# EAGLE design leachamp4_5 (EAGLE 5.06)
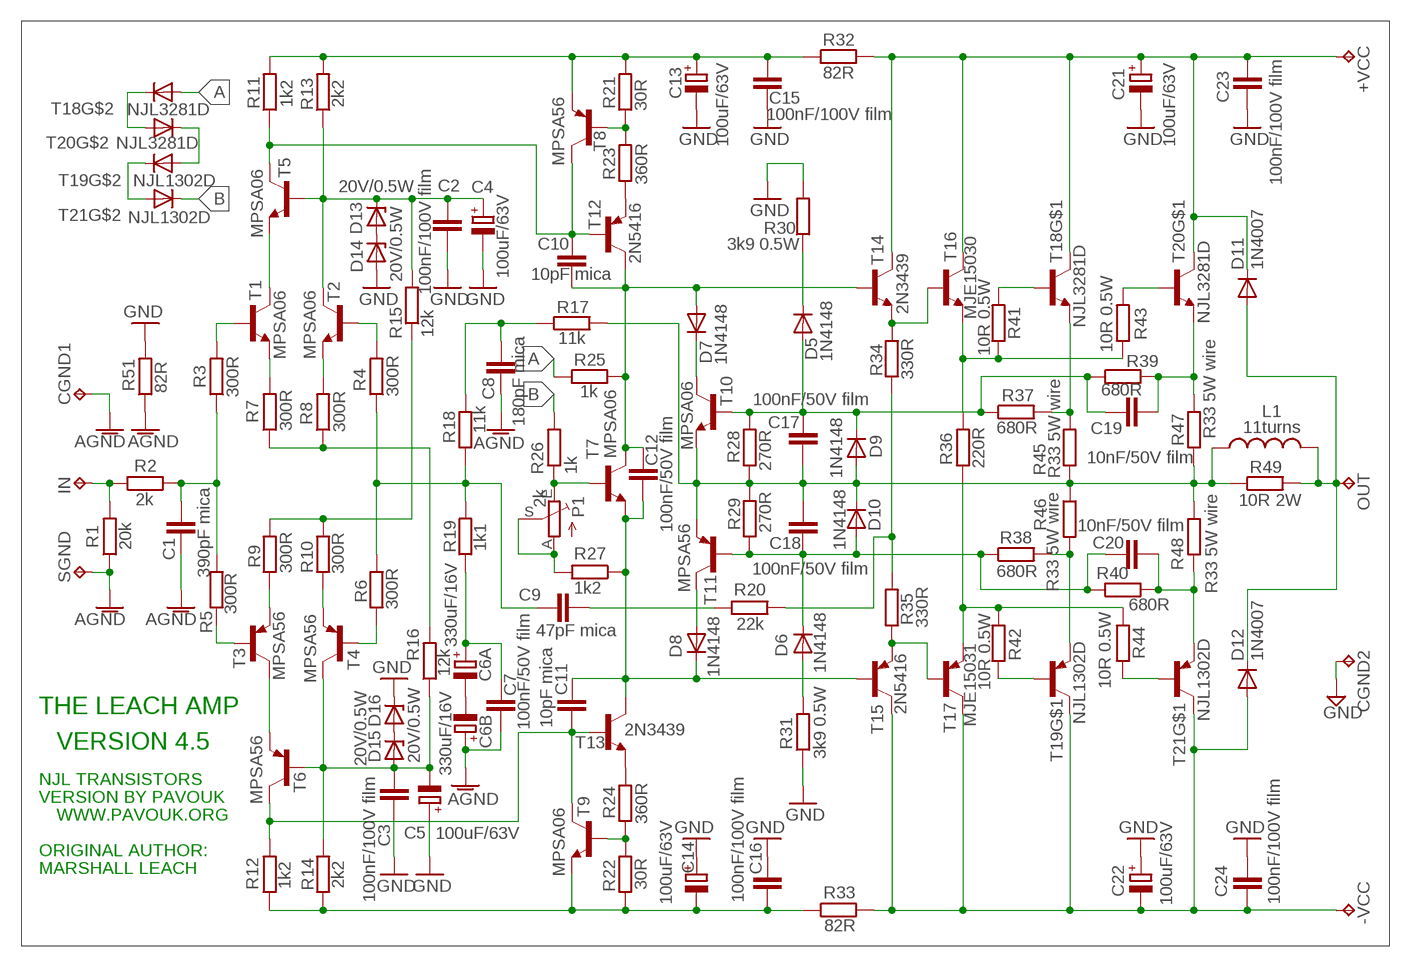
[diagram p0: schematic, sheet 1]

## Parts
+VCC  TPPAD1-20  [P1-20]
-VCC  TPPAD1-20  [P1-20]
C1  390pF mica  C-EU050-025X075  [C050-025X075]
C2  100nF/100V film  C-EU050-035X075  [C050-035X075]
C3  100nF/100V film  C-EU050-035X075  [C050-035X075]
C4  100uF/63V  CPOL-EUE5-8.5  [E5-8,5]
C5  100uF/63V  CPOL-EUE5-8.5  [E5-8,5]
C6A  330uF/16V  CPOL-EUE5-6  [E5-6]
C6B  330uF/16V  CPOL-EUE5-6  [E5-6]
C7  100nF/50V film  C-EU050-025X075  [C050-025X075]
C8  180pF mica  C-EU050-025X075  [C050-025X075]
C9  47pF mica  C-EU050-025X075  [C050-025X075]
C10  10pF mica  C-EU050-025X075  [C050-025X075]
C11  10pF mica  C-EU050-025X075  [C050-025X075]
C12  100nF/50V film  C-EU050-025X075  [C050-025X075]
C13  100uF/63V  CPOL-EUE5-8.5  [E5-8,5]
C14  100uF/63V  CPOL-EUE5-8.5  [E5-8,5]
C15  100nF/100V film  C-EU050-035X075  [C050-035X075]
C16  100nF/100V film  C-EU050-035X075  [C050-035X075]
C17  100nF/50V film  C-EU050-025X075  [C050-025X075]
C18  100nF/50V film  C-EU050-025X075  [C050-025X075]
C19  10nF/50V film  C-EU075-032X103  [C075-032X103]
C20  10nF/50V film  C-EU075-032X103  [C075-032X103]
C21  100uF/63V  CPOL-EUE5-8.5  [E5-8,5]
C22  100uF/63V  CPOL-EUE5-8.5  [E5-8,5]
C23  100nF/100V film  C-EU050-035X075  [C050-035X075]
C24  100nF/100V film  C-EU050-035X075  [C050-035X075]
CGND1  TPPAD1-17Y  [P1-17Y]
CGND2  TPPAD1-17Y  [P1-17Y]
D5  1N4148  1N4148DO35-10  [DO35-10]
D6  1N4148  1N4148DO35-10  [DO35-10]
D7  1N4148  1N4148DO35-10  [DO35-10]
D8  1N4148  1N4148DO35-10  [DO35-10]
D9  1N4148  1N4148DO35-7  [DO35-7]
D10  1N4148  1N4148DO35-7  [DO35-7]
D11  1N4007  1N4004  [DO41-10]
D12  1N4007  1N4004  [DO41-10]
D13  20V/0.5W  ZENER-DIODEZD-7.5  [ZDIO-7.5]
D14  20V/0.5W  ZENER-DIODEZD-7.5  [ZDIO-7.5]
D15  20V/0.5W  ZENER-DIODEZD-7.5  [ZDIO-7.5]
D16  20V/0.5W  ZENER-DIODEZD-7.5  [ZDIO-7.5]
IN  TPPAD1-17Y  [P1-17Y]
L1  11turns  L-USIRF-36  [IRF36]
OUT  TPPAD1-17Y  [P1-17Y]
P1  2k  TRIM_EU-S63P  [S63P]
R1  20k  R-EU_0207/10  [0207/10]
R2  2k  R-EU_0207/10  [0207/10]
R3  300R  R-EU_0207/10  [0207/10]
R4  300R  R-EU_0207/10  [0207/10]
R5  300R  R-EU_0207/10  [0207/10]
R6  300R  R-EU_0207/10  [0207/10]
R7  300R  R-EU_0207/10  [0207/10]
R8  300R  R-EU_0207/10  [0207/10]
R9  300R  R-EU_0207/10  [0207/10]
R10  300R  R-EU_0207/10  [0207/10]
R11  1k2  R-EU_0207/10  [0207/10]
R12  1k2  R-EU_0207/10  [0207/10]
R13  2k2  R-EU_0207/10  [0207/10]
R14  2k2  R-EU_0207/10  [0207/10]
R15  12k  R-EU_0207/10  [0207/10]
R16  12k  R-EU_0207/10  [0207/10]
R17  11k  R-EU_0207/10  [0207/10]
R18  11k  R-EU_0207/10  [0207/10]
R19  1k1  R-EU_0207/10  [0207/10]
R20  22k  R-EU_0207/10  [0207/10]
R21  30R  R-EU_0207/10  [0207/10]
R22  30R  R-EU_0207/10  [0207/10]
R23  360R  R-EU_0207/10  [0207/10]
R24  360R  R-EU_0207/10  [0207/10]
R25  1k  R-EU_0207/10  [0207/10]
R26  1k  R-EU_0207/10  [0207/10]
R27  1k2  R-EU_0207/10  [0207/10]
R28  270R  R-EU_0207/10  [0207/10]
R29  270R  R-EU_0207/10  [0207/10]
R30  3k9 0.5W  R-EU_0207/10  [0207/10]
R31  3k9 0.5W  R-EU_0207/10  [0207/10]
R32  82R  R-EU_0207/10  [0207/10]
R33  82R  R-EU_0207/10  [0207/10]
R34  330R  R-EU_0207/10  [0207/10]
R35  330R  R-EU_0207/10  [0207/10]
R36  220R  R-EU_0207/12  [0207/12]
R37  680R  R-EU_0207/10  [0207/10]
R38  680R  R-EU_0207/10  [0207/10]
R39  680R  R-EU_0207/10  [0207/10]
R40  680R  R-EU_0207/10  [0207/10]
R41  10R 0.5W  R-EU_0207/10  [0207/10]
R42  10R 0.5W  R-EU_0207/10  [0207/10]
R43  10R 0.5W  R-EU_0207/10  [0207/10]
R44  10R 0.5W  R-EU_0207/10  [0207/10]
R45  R33 5W wire  R-EU_0922V  [0922V]
R46  R33 5W wire  R-EU_0922V  [0922V]
R47  R33 5W wire  R-EU_0922V  [0922V]
R48  R33 5W wire  R-EU_0922V  [0922V]
R49  10R 2W  R-EU_0817/22  [P0817/22]
R51  82R  R-EU_0207/10  [0207/10]
SGND  TPPAD1-17Y  [P1-17Y]
T1  MPSA06  BC546A-NPN-TO92-EBC  [TO92-EBC]
T2  MPSA06  BC546A-NPN-TO92-EBC  [TO92-EBC]
T3  MPSA56  BC556A-PNP-TO92-EBC  [TO92-EBC]
T4  MPSA56  BC556A-PNP-TO92-EBC  [TO92-EBC]
T5  MPSA06  BC546A-NPN-TO92-EBC  [TO92-EBC]
T6  MPSA56  BC556A-PNP-TO92-EBC  [TO92-EBC]
T7  MPSA06  BC546A-NPN-TO92-EBC  [TO92-EBC]
T8  MPSA56  BC556A-PNP-TO92-EBC  [TO92-EBC]
T9  MPSA06  BC546A-NPN-TO92-EBC  [TO92-EBC]
T10  MPSA06  BC546A-NPN-TO92-EBC  [TO92-EBC]
T11  MPSA56  BC556A-PNP-TO92-EBC  [TO92-EBC]
T12  2N5416  2N5416-PNP-TO39-EBC  [TO39]
T13  2N3439  [TO5]
T14  2N3439  [TO5]
T15  2N5416  2N5416-PNP-TO39-EBC  [TO39]
T16  MJE15030  -NPN-TO220V  [TO220V]
T17  MJE15031  -PNP-TO220V  [TO220V]
T18  NJL3281D  [TO264-5]
T19  NJL1302D  [TO264-5]
T20  NJL3281D  [TO264-5]
T21  NJL1302D  [TO264-5]

## Nets
A: R25.1 T18.ANODE(A)
AGND: C1.2 C6B.+ C7.2 C8.2 CGND1.1(TP) R1.1 R51.1 SGND.1(TP)
B: R26.2 T21.CATHODE(C)
GND: C2.2 C3.2 C4.- C5.+ C13.- C14.+ C15.2 C16.1 C21.- C22.+ C23.2 C24.1 CGND2.1(TP) D14.A D16.C R30.2 R31.1 R51.2
N$1: R21.1 R23.2 T8.B
N$2: R22.2 R24.1 T9.B
N$3: C17.2 C18.1 D9.A D10.C L1.1 R17.2 R28.1 R29.2 R45.1 R46.1 R47.1 R48.1 R49.1 T10.E T11.E
N$4: D13.A D14.C
N$5: D15.C D16.A
N$6: T18.CATHODE(C) T20.ANODE(A)
N$7: T19.ANODE(A) T20.CATHODE(C)
N$8: T19.CATHODE(C) T21.ANODE(A)
N$9: R24.2 T13.1(E)
N$10: D11.A D12.C L1.2 OUT.1(TP) R49.2
N$11: C8.1 R17.1 R18.2
N$12: P1.A P1.S R27.2
N$13: P1.E R26.1 T7.B
N$14: C14.- C16.2 R12.1 R14.1 R22.1 R33.1 T9.E
N$15: C11.1 C12.2 D8.C R27.1 T7.E T13.3(C) T15.2(B)
N$16: C10.2 C12.1 D7.A R25.2 T7.C T12.3(C) T14.2(B)
N$17: C11.2 R12.2 T6.C T9.C T13.2(B)
N$18: R23.1 T12.1(E)
N$19: C13.+ C15.1 R11.2 R13.2 R21.2 R32.1 T8.E
N$20: C10.1 R11.1 T5.C T8.C T12.2(B)
N$21: R4.2 T2.B
N$22: R3.2 T1.B
N$23: R8.2 T2.E
N$24: R7.2 T1.E
N$25: R7.1 R8.1 R16.2
N$26: R9.2 R10.2 R15.1
N$27: C9.1 R4.1 R6.2 R18.1 R19.2
N$28: D8.A T11.C
N$29: R5.1 T3.B
N$30: R6.1 T4.B
N$32: R37.2 R45.2 T18.EMITTER(E)
N$33: C6A.+ C7.1 R19.1
N$34: R35.1 T15.1(E) T17.1(B)
N$35: C1.1 R2.2 R3.1 R5.2
N$36: IN.1(TP) R1.2 R2.1
N$37: C3.1 C5.- D15.A R14.2 R16.1 T4.C T6.B
N$38: T3.C T6.E
N$39: R9.1 T3.E
N$40: R10.1 T4.E
N$41: C2.1 C4.+ D13.C R13.1 R15.2 T2.C T5.B
N$42: T1.C T5.E
N$43: R20.2 R34.1 R35.2
N$44: D6.A R31.2
N$45: D5.C R30.1
N$46: C9.2 R20.1
N$47: C17.1 C19.1 D5.A D9.C R28.2 R37.1 R39.1 T10.B
N$48: C18.2 C20.1 D6.C D10.A R29.1 R38.1 R40.1 T11.B
N$49: D7.C T10.C
N$50: R38.2 R46.2 T19.EMITTER(E)
N$51: R34.2 T14.1(E) T16.1(B)
N$52: C6A.- C6B.-
N$53: C20.2 R40.2 R48.2 T21.EMITTER(E)
N$54: C19.2 R39.2 R47.2 T20.EMITTER(E)
N$56: R41.2 T18.BASE(B)
N$57: R43.2 T20.BASE(B)
N$58: R36.2 R41.1 R43.1 T16.3(E)
N$60: R44.1 T21.BASE(B)
N$61: R42.1 T19.BASE(B)
N$62: R36.1 R42.2 R44.2 T17.3(E)
N$63: -VCC.1(TP) C22.- C24.2 D12.A R33.2 T15.3(C) T17.2(C) T19.COLLECTOR(C) T21.COLLECTOR(C)
N$64: +VCC.1(TP) C21.+ C23.1 D11.C R32.2 T14.3(C) T16.2(C) T18.COLLECTOR(C) T20.COLLECTOR(C)

## Notes on the sheet
- THE LEACH AMP
- VERSION 4.5
- NJL TRANSISTORS
- VERSION BY PAVOUK
- WWW.PAVOUK.ORG
- ORIGINAL AUTHOR:
- MARSHALL LEACH

## Library data of the parts
+VCC -VCC CGND1 CGND2 IN OUT SGND = testpad:TP: Test pad
C1-C3 C7-C12 C15-C20 C23 C24 = rcl:C-EU: CAPACITOR, European symbol
C4 C5 C6A C6B C13 C14 C21 C22 = rcl:CPOL-EU: POLARIZED CAPACITOR, European symbol
D5-D10 = diode:1N4148: DIODE high speed (Philips)
D11 D12 = diode:1N4004: DIODE general purpose rectifier, 1 A
D13-D16 = diode:ZENER-DIODE: Z-Diode
L1 = rcl:L-US: INDUCTOR, American symbol
P1 = pot:TRIM_EU-: POTENTIOMETER
R1-R49 R51 = rcl:R-EU_: RESISTOR, European symbol
T1 T2 T5 T7 T9 T10 T16 = transistor:*-NPN-: NPN Transistror BF959 corrected 2008.03.06
T3 T4 T6 T8 T11 T12 T15 T17 = transistor:*-PNP-: PNP Transistror
T13 T14 = transistor:2N3439: NPN TRANSISTOR
T18 T20 = pavouk:NJL3281D: Bipolar power transistor 15 AMP, 260 VOLT, 200 WATT with bias diode.
T19 T21 = pavouk:NJL1302D: Bipolar power transistor 15 AMP, 260 VOLT, 200 WATT with bias diode.

## Board
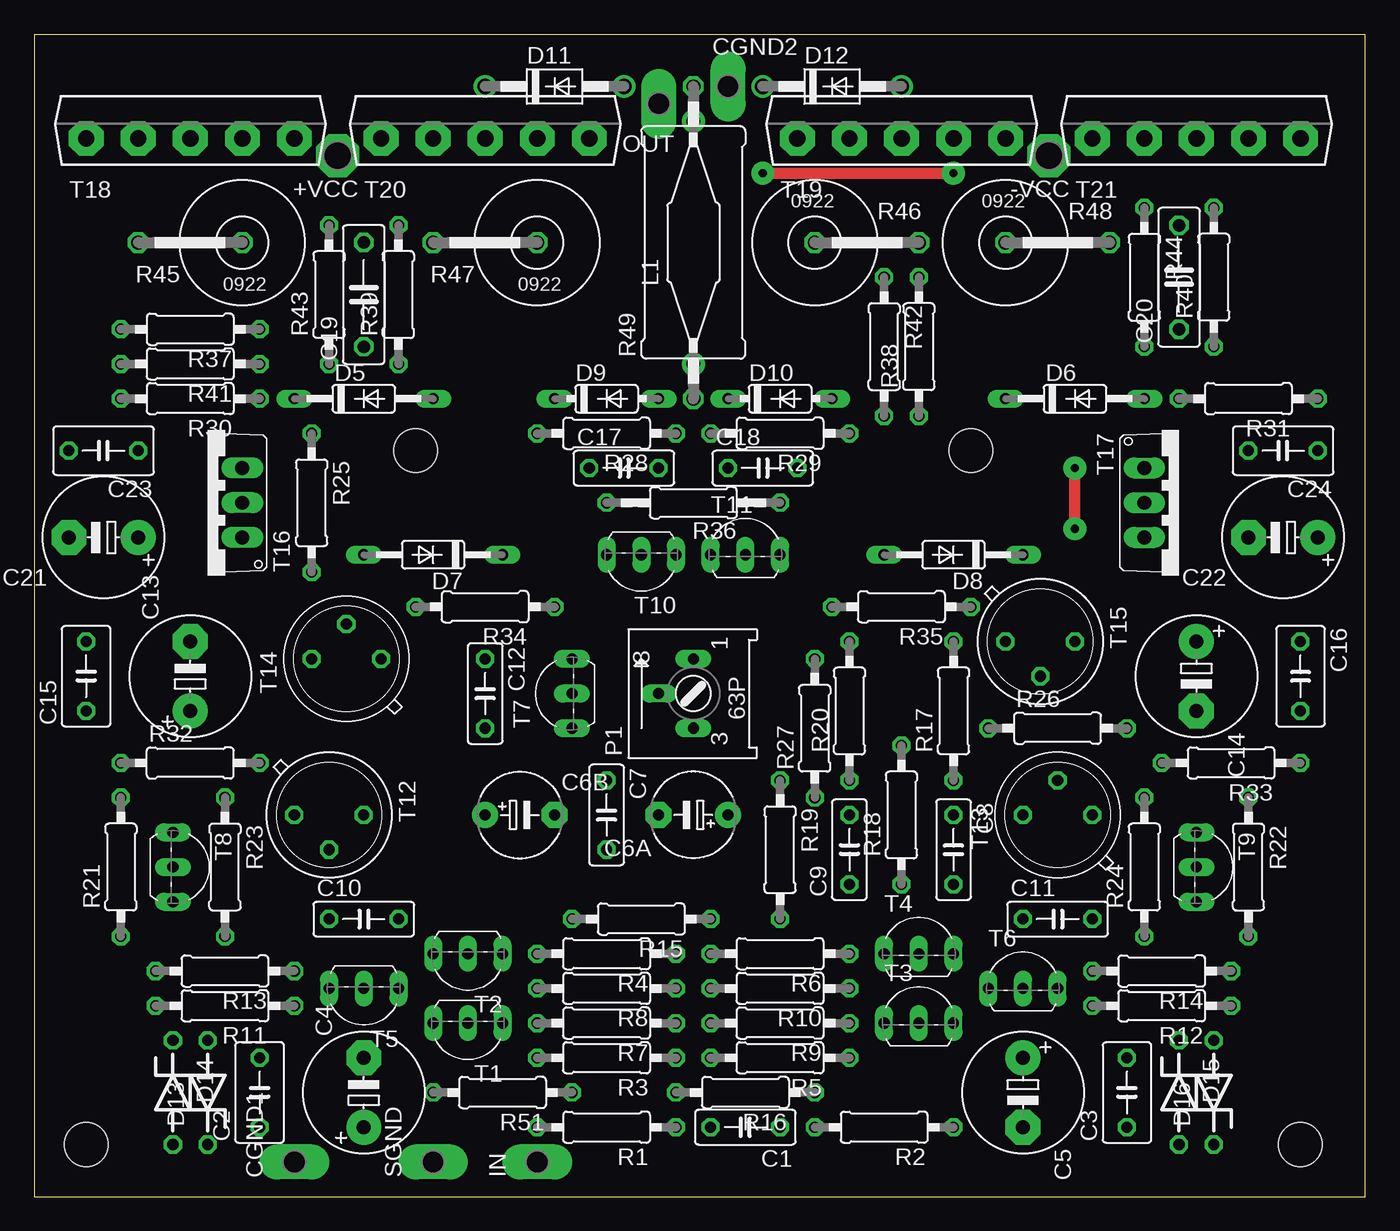
[diagram p1: board, top side]
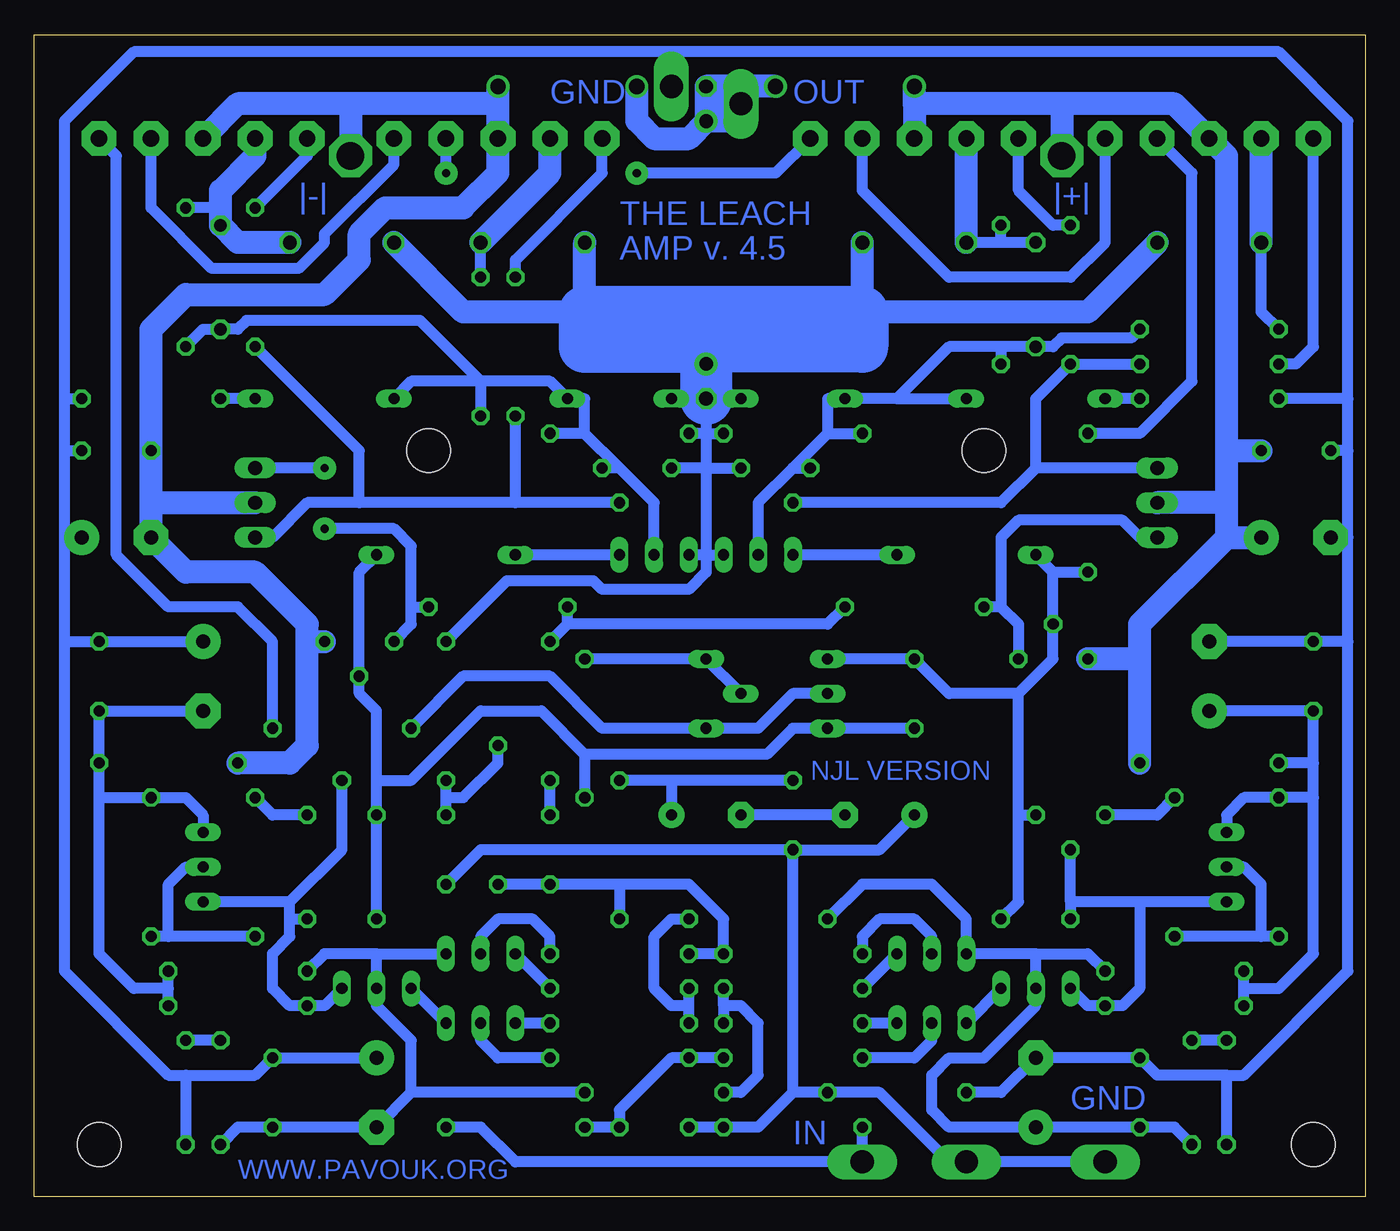
[diagram p2: board, bottom side, seen from below]

Size 97.46 x 85.08 mm. Coordinates in mm from the lower left corner, seen from the top.
Outline: 0,0 97.46,0 97.46,85.08 0,85.08 0,0
Copper layers (1*16): Top 0.035mm / dielectric 1.5mm / Bottom 0.035mm
Design rules "default *": minimum track width 10mil, minimum drill 24mil, track to track 8mil, track to pad 8mil, pad to pad 8mil, via to via 8mil, smd to smd 8mil, copper to edge 40mil, drill to drill 8mil, minimum pad ring 10mil, minimum via ring 8mil, stop-mask expansion 4mil, vias tented up to drill 0mil, thermal gap 10mil
Holes 3.2 mm at 3.81,3.81 92.71,3.81 27.94,54.61 68.58,54.61

### Footprints (pad centres in the part's own frame; a part is rotated, then mirrored left to right if it is on the bottom)
P1-20 = drill 2.007 pad 3.15 octagon: 1 0,0
C050-025X075 = drill 0.813 octagon: 1 -2.54,0; 2 2.54,0
C050-035X075 = drill 0.813 octagon: 1 -2.54,0; 2 2.54,0
E5-8,5 = drill 1.016 pad 2.54 round: + -2.54,0 | drill 1.016 pad 2.54 octagon: - 2.54,0
E5-6 = drill 0.813 pad 1.905 round: + -2.54,0 | drill 0.813 pad 1.905 octagon: - 2.54,0
C075-032X103 = drill 0.914 octagon: 1 -3.81,0; 2 3.81,0
P1-17Y = drill 1.702 pad 2.121 long: 1 0,0
DO35-10 = drill 0.813 long: A 5.08,0; C -5.08,0
DO35-7 = drill 0.813 long: A 3.81,0; C -3.81,0
DO41-10 = drill 1.118 round: A 5.08,0; C -5.08,0
ZDIO-7.5 = drill 0.813 octagon: A 3.81,0; C -3.81,0
IRF36 = drill 1 pad 1.676 round: 1 -8.89,0; 2 8.89,0
S63P = drill 0.813 long: A 2.54,0; E -2.54,0; S 0,2.54
0207/10 = drill 0.813 octagon: 1 -5.08,0; 2 5.08,0
0207/12 = drill 0.813 octagon: 1 -6.35,0; 2 6.35,0
0922V = drill 1.016 octagon: 1 -5.08,0; 2 2.54,0
P0817/22 = drill 1.016 octagon: 1 -11.43,0; 2 11.43,0
TO92-EBC = drill 0.813 long: B 0,-1.27; C 2.54,-1.27; E -2.54,-1.27
TO39 = drill 0.813 octagon: 1 0,-2.54; 2 2.54,0; 3 0,2.54
TO5 = drill 0.813 octagon: 1 0,-2.54; 2 2.54,0; 3 0,2.54
TO220V = drill 1.016 long: 1 -2.54,-2.54; 2 0,-2.54; 3 2.54,-2.54
TO264-5 = drill 1.2 pad 2.54 octagon: ANODE 3.81,0; BASE -7.62,0; CATHODE 7.62,0; COLLECTOR 0,0; EMITTER -3.81,0

### Placement (x,y rotation side)
+VCC  22.23,76.2 180 top
-VCC  74.3,76.2 180 top
C1  52.07,5.08 180 top
C2  16.51,7.62 90 top
C3  80.01,7.62 90 top
C4  24.13,7.62 90 top
C5  72.39,7.62 270 top
C6A  48.26,27.94 180 top
C6B  35.56,27.94 0 top
C7  41.91,27.94 270 top
C8  67.31,25.4 270 top
C9  59.69,25.4 90 top
C10  24.13,20.32 0 top
C11  74.93,20.32 0 top
C12  33.02,36.83 270 top
C13  11.43,38.1 90 top
C14  85.09,38.1 270 top
C15  3.81,38.1 90 top
C16  92.71,38.1 270 top
C17  43.18,53.34 0 top
C18  53.34,53.34 0 top
C19  24.13,66.04 90 top
C20  83.82,67.31 90 top
C21  5.08,48.26 180 top
C22  91.44,48.26 180 top
C23  5.08,54.61 180 top
C24  91.44,54.61 180 top
CGND1  19.05,2.54 90 top
CGND2  50.8,81.28 0 top
D5  24.13,58.42 0 top
D6  76.2,58.42 0 top
D7  29.21,46.99 180 top
D8  67.31,46.99 180 top
D9  41.91,58.42 0 top
D10  54.61,58.42 0 top
D11  38.1,81.28 0 top
D12  58.42,81.28 0 top
D13  12.7,7.62 90 top
D14  10.16,7.62 270 top
D15  83.82,7.62 270 top
D16  86.36,7.62 90 top
IN  36.83,2.54 90 top
L1  48.26,69.85 90 top
OUT  45.72,80.01 180 top
P1  48.26,36.83 90 top
R1  41.91,5.08 180 top
R2  62.23,5.08 180 top
R3  41.91,10.16 180 top
R4  41.91,17.78 180 top
R5  54.61,10.16 180 top
R6  54.61,17.78 180 top
R7  41.91,12.7 180 top
R8  41.91,15.24 180 top
R9  54.61,12.7 180 top
R10  54.61,15.24 180 top
R11  13.97,13.97 180 top
R12  82.55,13.97 180 top
R13  13.97,16.51 180 top
R14  82.55,16.51 180 top
R15  44.45,20.32 180 top
R16  52.07,7.62 180 top
R17  67.31,35.56 90 top
R18  63.5,27.94 90 top
R19  54.61,25.4 270 top
R20  59.69,35.56 90 top
R21  6.35,24.13 90 top
R22  88.9,24.13 270 top
R23  13.97,24.13 270 top
R24  81.28,24.13 90 top
R25  20.32,50.8 270 top
R26  74.93,34.29 0 top
R27  57.15,34.29 90 top
R28  41.91,55.88 180 top
R29  54.61,55.88 180 top
R30  11.43,58.42 180 top
R31  88.9,58.42 180 top
R32  11.43,31.75 0 top
R33  87.63,31.75 180 top
R34  33.02,43.18 180 top
R35  63.5,43.18 180 top
R36  48.26,50.8 180 top
R37  11.43,63.5 180 top
R38  64.77,62.23 90 top
R39  26.67,66.04 90 top
R40  86.36,67.31 90 top
R41  11.43,60.96 180 top
R42  62.23,62.23 270 top
R43  21.59,66.04 90 top
R44  81.28,67.31 270 top
R45  10.16,69.85 180 top
R46  62.23,69.85 0 top
R47  31.75,69.85 180 top
R48  76.2,69.85 0 top
R49  48.26,69.85 90 top
R51  34.29,7.62 180 top
SGND  29.21,2.54 90 top
T1  31.75,11.43 180 top
T2  31.75,16.51 180 top
T3  64.77,13.97 0 top
T4  64.77,19.05 0 top
T5  24.13,13.97 180 top
T6  72.39,16.51 0 top
T7  38.1,36.83 90 top
T8  11.43,24.13 270 top
T9  86.36,24.13 270 top
T10  44.45,45.72 180 top
T11  52.07,48.26 0 top
T12  21.59,27.94 270 top
T13  74.93,27.94 90 top
T14  22.86,39.37 90 top
T15  73.66,40.64 270 top
T16  12.7,50.8 90 top
T17  83.82,50.8 270 top
T18  11.43,77.47 0 top
T19  63.5,77.47 0 top
T20  33.02,77.47 0 top
T21  85.09,77.47 0 top

### Tracks (layer width: path | path; a pad name or v marks a point on that pad's centre or on a via)
A
  Bottom 0.813: R25.1 16.51,55.88 12.7,59.69 12.7,74.93 T18.ANODE
AGND
  Bottom 0.813: C1.2 R1.1 44.45,5.08 41.91,7.62 | 41.91,7.62 R51.1 35.56,7.62 30.48,2.54 SGND.1 CGND1.1 | 41.91,7.62 C7.2 | C6B.+ 35.56,25.4 C7.2 | C8.2 64.77,25.4 C7.2
B
  Bottom 0.813: R26.2 80.01,40.64 82.55,43.18 87.63,43.18 91.44,46.99 91.44,76.2 T21.CATHODE
GND
  Bottom 0.813: C5.+ C3.2 81.28,8.89 86.36,8.89 | 86.36,8.89 D16.C | 10.16,8.89 15.24,8.89 C2.2 C4.- 26.67,7.62 R51.2 | D14.A 10.16,8.89 | C13.- C15.2 1.27,40.64 | C14.+ C16.1 95.25,40.64 | 1.27,40.64 1.27,16.51 8.89,8.89 10.16,8.89 | 95.25,40.64 95.25,16.51 87.63,8.89 86.36,8.89 | 95.25,58.42 95.25,54.61 | 95.25,54.61 95.25,48.26 | 95.25,48.26 95.25,40.64 | 95.25,58.42 R31.1 | 1.27,58.42 R30.2 | 1.27,40.64 1.27,48.26 | 1.27,48.26 1.27,54.61 | 1.27,54.61 1.27,58.42 | 95.25,58.42 95.25,78.74 90.17,83.82 50.8,83.82 | 50.8,83.82 6.35,83.82 1.27,78.74 1.27,58.42 | 1.27,54.61 C23.2 | 1.27,48.26 C21.- | 95.25,48.26 C22.+ | 95.25,54.61 C24.1 | 50.8,83.82 CGND2.1
N$1
  Bottom 0.813: R21.1 7.62,19.05 | 7.62,19.05 R23.2 | T8.B 8.89,24.13 7.62,22.86 7.62,19.05
N$2
  Bottom 0.813: R24.1 87.63,19.05 | 87.63,19.05 R22.2 | T9.B 86.36,24.13 87.63,22.86 87.63,19.05
N$3
  Bottom 0.813: 48.26,46.99 T10.E | 48.26,46.99 T11.E | 48.26,53.34 C17.2 | 48.26,53.34 48.26,46.99 | 48.26,53.34 C18.1 | 48.26,55.88 48.26,53.34 | R49.1 48.26,55.88 | R49.1 D9.A | R49.1 D10.C | 48.26,46.99 48.26,45.72 49.53,44.45 55.88,44.45 56.52,45.09 62.87,45.09 R17.2 | 48.26,55.88 R28.1 | 48.26,55.88 R29.2
  Bottom 1.676: R45.1 20.32,64.77 36.83,64.77 R47.1 | R48.1 66.04,64.77 57.15,64.77 R46.1
  Bottom 3.81: 48.26,62.23 36.83,62.23 36.83,64.77 57.15,64.77 57.15,62.23 48.26,62.23 | 48.26,62.23 L1.1 R49.1
N$4
  Bottom 0.813: D14.C D13.A
N$5
  Bottom 0.813: D15.C D16.A
N$6
  Bottom 0.813: T18.CATHODE 19.05,69.85 21.59,67.31 30.48,67.31 36.83,73.66 T20.ANODE
N$7  (via drill 0.6 pad 1.68)
  Top 0.813: v53.34,74.93 v67.31,74.93
  Bottom 0.813: T20.CATHODE 43.18,74.93 v53.34,74.93 | v67.31,74.93 T19.ANODE
N$8
  Bottom 0.813: T21.ANODE 88.9,72.39 84.45,67.94 78.11,67.94 76.2,69.85 76.2,70.48 71.12,75.56 T19.CATHODE
N$9
  Bottom 0.813: T13.1 80.01,27.94 R24.2
N$10
  Bottom 1.676: D12.C 53.34,78.74 52.07,77.47 49.53,77.47 L1.2 | 48.26,80.01 R49.2 45.72,81.28 | 48.26,80.01 L1.2 | L1.2 45.72,78.74 OUT.1 | OUT.1 48.26,80.01 | 45.72,81.28 OUT.1 | D11.A 45.72,81.28
N$11
  Bottom 0.813: C8.1 67.31,29.21 | 67.31,29.21 R17.1 | R18.2 63.5,31.75 66.04,29.21 67.31,29.21
N$12
  Bottom 0.813: R27.2 P1.A P1.S
N$13
  Bottom 0.813: R26.1 66.04,38.1 59.69,38.1 55.88,34.29 P1.E 44.45,34.29 41.91,36.83 T7.B
N$14
  Bottom 0.813: R12.1 87.63,15.24 | 87.63,15.24 R14.1 | T9.E 85.09,27.94 86.36,29.21 R22.1 92.71,29.21 | 92.71,29.21 92.71,17.78 90.17,15.24 87.63,15.24 | C14.- C16.2 R33.1 92.71,29.21
N$15
  Bottom 0.813: C12.2 T7.E 41.91,34.29 43.81,32.38 57.15,32.38 | 57.15,32.38 R27.1 | C11.1 T13.3 72.39,30.48 | D8.C 73.66,45.72 T15.2 73.66,36.83 72.39,35.56 72.39,30.48 | 72.39,30.48 69.85,30.48 64.77,35.56 60.33,35.56 57.15,32.38
N$16
  Bottom 0.813: 25.4,27.94 T12.3 | T7.C C12.1 30.48,36.83 25.4,36.83 | 25.4,27.94 25.4,21.59 C10.2 | 22.86,45.72 T14.2 22.86,39.37 25.4,36.83 | 22.86,45.72 D7.A | 22.86,45.72 R25.2 | 25.4,27.94 25.4,36.83
N$17
  Bottom 0.813: T6.C 76.2,13.97 R12.2 78.74,13.97 80.01,15.24 80.01,17.78 78.74,19.05 78.74,20.32 | 78.74,20.32 78.74,21.59 | 78.74,21.59 74.93,25.4 T13.2 | 78.74,20.32 C11.2 | 78.74,21.59 T9.C
N$18
  Bottom 0.813: T12.1 15.24,27.94 R23.1
N$19
  Bottom 0.813: R11.2 8.89,15.24 | 8.89,15.24 R13.2 | 3.81,29.21 R21.2 8.89,29.21 10.16,27.94 T8.E | 3.81,29.21 3.81,17.78 6.35,15.24 8.89,15.24 | C13.+ C15.1 3.81,31.75 | 3.81,29.21 3.81,31.75 | 3.81,31.75 R32.1
N$20
  Bottom 0.813: T5.C 20.32,13.97 R11.1 17.78,13.97 16.51,15.24 16.51,21.59 | 21.59,21.59 C10.1 | 21.59,21.59 T12.2 | T8.C 16.51,21.59 | 16.51,21.59 21.59,21.59
N$21
  Bottom 0.813: T2.B 31.75,19.05 33.02,20.32 35.56,20.32 36.83,19.05 R4.2
N$22
  Bottom 0.813: R3.2 33.02,10.16 31.75,11.43 T1.B
N$23
  Bottom 0.813: T2.E R8.2
N$24
  Bottom 0.813: T1.E R7.2
N$25
  Bottom 0.813: 46.99,13.97 R7.1 | 46.99,13.97 R8.1 | R16.2 45.72,7.62 44.45,8.89 44.45,12.7 45.72,13.97 46.99,13.97
N$26
  Bottom 0.813: R9.2 49.53,13.97 | 49.53,13.97 R10.2 | R15.1 50.8,20.32 52.07,19.05 52.07,15.24 50.8,13.97 49.53,13.97
N$27
  Bottom 0.813: R18.1 C9.1 54.61,22.86 | R6.2 R4.1 46.99,20.32 49.53,22.86 54.61,22.86 | 54.61,22.86 R19.2
N$28
  Bottom 0.813: T11.C D8.A
N$29
  Bottom 0.813: R5.1 63.5,10.16 64.77,11.43 T3.B
N$30
  Bottom 0.813: T4.B 64.77,19.05 63.5,20.32 60.96,20.32 59.69,19.05 R6.1
N$32
  Bottom 0.813: R45.2 7.62,64.77 R37.2
  Bottom 1.676: R45.2 T18.EMITTER
N$33
  Bottom 0.813: C7.1 50.8,30.48 | 50.8,30.48 R19.1 | 50.8,30.48 C6A.+
N$34  (via drill 0.6 pad 1.68)
  Top 0.813: v76.2,48.9 v76.2,53.34
  Bottom 0.813: v76.2,53.34 T17.1 | T15.1 69.85,41.91 69.85,43.18 | 69.85,43.18 R35.1 | 69.85,43.18 69.85,47.62 71.12,48.9 v76.2,48.9
N$35
  Bottom 0.813: R2.2 C1.1 54.61,6.35 50.8,10.16 R5.2 R3.1
N$36
  Bottom 0.813: R2.1 64.77,5.08 62.23,2.54 IN.1 R1.2
N$37
  Bottom 0.813: R16.1 69.85,7.62 | D15.A 82.55,5.08 C3.1 C5.- 69.85,7.62 | 72.39,17.78 T6.B 72.39,13.97 69.85,11.43 69.85,7.62 | 72.39,17.78 T4.C | R14.2 76.2,17.78 72.39,17.78
N$38
  Bottom 0.813: T3.C T6.E
N$39
  Bottom 0.813: R9.1 T3.E
N$40
  Bottom 0.813: R10.1 T4.E
N$41
  Bottom 0.813: D13.C 13.97,5.08 C2.1 C4.+ 30.48,5.08 31.75,6.35 31.75,8.89 30.48,10.16 27.94,10.16 24.13,13.97 T5.B 24.13,17.78 | 24.13,17.78 T2.C 29.21,20.32 31.75,22.86 36.83,22.86 R15.2 | R13.1 20.32,17.78 24.13,17.78
N$42
  Bottom 0.813: T5.E T1.C
N$43
  Bottom 0.813: 58.42,41.91 R20.2 | 58.42,41.91 R35.2 | R34.1 39.37,41.91 58.42,41.91
N$44
  Bottom 0.813: D6.A R31.2
N$45
  Bottom 0.813: R30.1 D5.C
N$46
  Bottom 0.813: C9.2 R20.1
N$47
  Bottom 0.813: T10.B 44.45,50.8 41.91,53.34 | 39.37,55.88 R28.2 | 39.37,55.88 41.91,53.34 | 41.91,53.34 C17.1 | R37.1 17.14,62.87 22.23,62.87 22.86,62.23 C19.1 26.67,62.23 | 26.67,62.23 R39.1 | 34.29,58.42 D5.A | 34.29,58.42 D9.C 39.37,58.42 39.37,55.88 | 26.67,62.23 30.48,62.23 34.29,58.42
N$48
  Bottom 0.813: T11.B 52.07,50.8 54.61,53.34 | 54.61,53.34 C18.2 | 57.15,55.88 R29.1 | 54.61,53.34 57.15,55.88 | 57.15,55.88 57.15,58.42 D10.A 59.69,59.69 64.77,59.69 | R40.1 85.09,63.5 C20.1 82.55,63.5 81.92,64.14 69.22,64.14 64.77,59.69 | 64.77,59.69 69.85,59.69 D6.C | 64.77,59.69 R38.1
N$49
  Bottom 0.813: D7.C T10.C
N$50
  Bottom 0.813: R38.2 R46.2
  Bottom 1.676: T19.EMITTER 59.69,74.93 R46.2
N$51
  Bottom 0.813: T14.1 25.4,41.91 26.67,43.18 | 26.67,43.18 R34.2 | 26.67,43.18 26.67,48.26 25.4,49.53 17.78,49.53 16.51,48.26 T16.1
N$52
  Bottom 0.813: C6B.- C6A.-
N$53
  Bottom 0.813: 83.82,72.39 R40.2
  Bottom 1.676: R48.2 82.55,69.85 C20.2 83.82,72.39 83.82,73.66 81.28,76.2 T21.EMITTER
N$54
  Bottom 0.813: C19.2 26.67,69.85 | 26.67,69.85 R47.2 | 26.67,69.85 R39.2
  Bottom 1.676: R47.2 T20.EMITTER
N$56
  Bottom 0.813: T18.BASE 3.81,62.23 5.08,60.96 R41.2
N$57
  Bottom 0.813: R43.2 22.86,71.12 25.4,73.66 T20.BASE
N$58
  Bottom 0.813: T16.3 24.13,53.34 | 24.13,53.34 24.13,58.42 R43.1 R41.1 | 24.13,53.34 26.67,50.8 R36.2
N$60
  Bottom 0.813: R44.1 77.47,76.2 T21.BASE
N$61
  Bottom 0.813: T19.BASE 55.88,74.93 62.23,68.58 R42.1
N$62
  Bottom 0.813: R36.1 62.23,50.8 | 62.23,50.8 R42.2 | 62.23,50.8 73.66,50.8 | 73.66,50.8 73.66,54.61 R44.2 | 73.66,50.8 77.47,50.8 80.01,48.26 T17.3
N$63
  Bottom 1.676: 63.5,80.01 T19.COLLECTOR 63.5,74.93 66.04,72.39 71.75,72.39 73.66,70.48 73.66,68.58 76.2,66.04 86.36,66.04 88.9,63.5 C24.2 88.9,50.8 | 63.5,80.01 74.3,80.01 | 74.3,80.01 82.55,80.01 T21.COLLECTOR | 74.3,80.01 -VCC.1 | 88.9,50.8 C22.- 86.36,45.72 81.28,45.72 77.47,41.91 77.47,40.64 | 88.9,50.8 T17.2 | R33.2 78.74,31.75 77.47,33.02 77.47,40.64 | 77.47,40.64 T15.3 | 63.5,80.01 D12.A
N$64
  Bottom 1.676: 16.51,39.37 T14.3 | R32.2 16.51,39.37 | 16.51,39.37 16.51,41.91 10.16,48.26 | 10.16,50.8 T16.2 | 10.16,48.26 10.16,50.8 | 10.16,50.8 10.16,54.61 | 33.02,80.01 T20.COLLECTOR | 22.23,80.01 13.97,80.01 T18.COLLECTOR 10.16,76.2 10.16,54.61 | 22.23,80.01 33.02,80.01 | 22.23,80.01 +VCC.1 | 10.16,54.61 C23.1 | 10.16,48.26 C21.+ | 33.02,80.01 D11.C

### Text on the board
Bottom: OUT | GND | |+| | |-| | THE LEACH | AMP v. 4.5 | NJL VERSION | GND | IN | WWW.PAVOUK.ORG